# Altium schematic sheet 05_Part-3.SchDoc
size A3; SheetNumber: 5; SheetTotal: 5
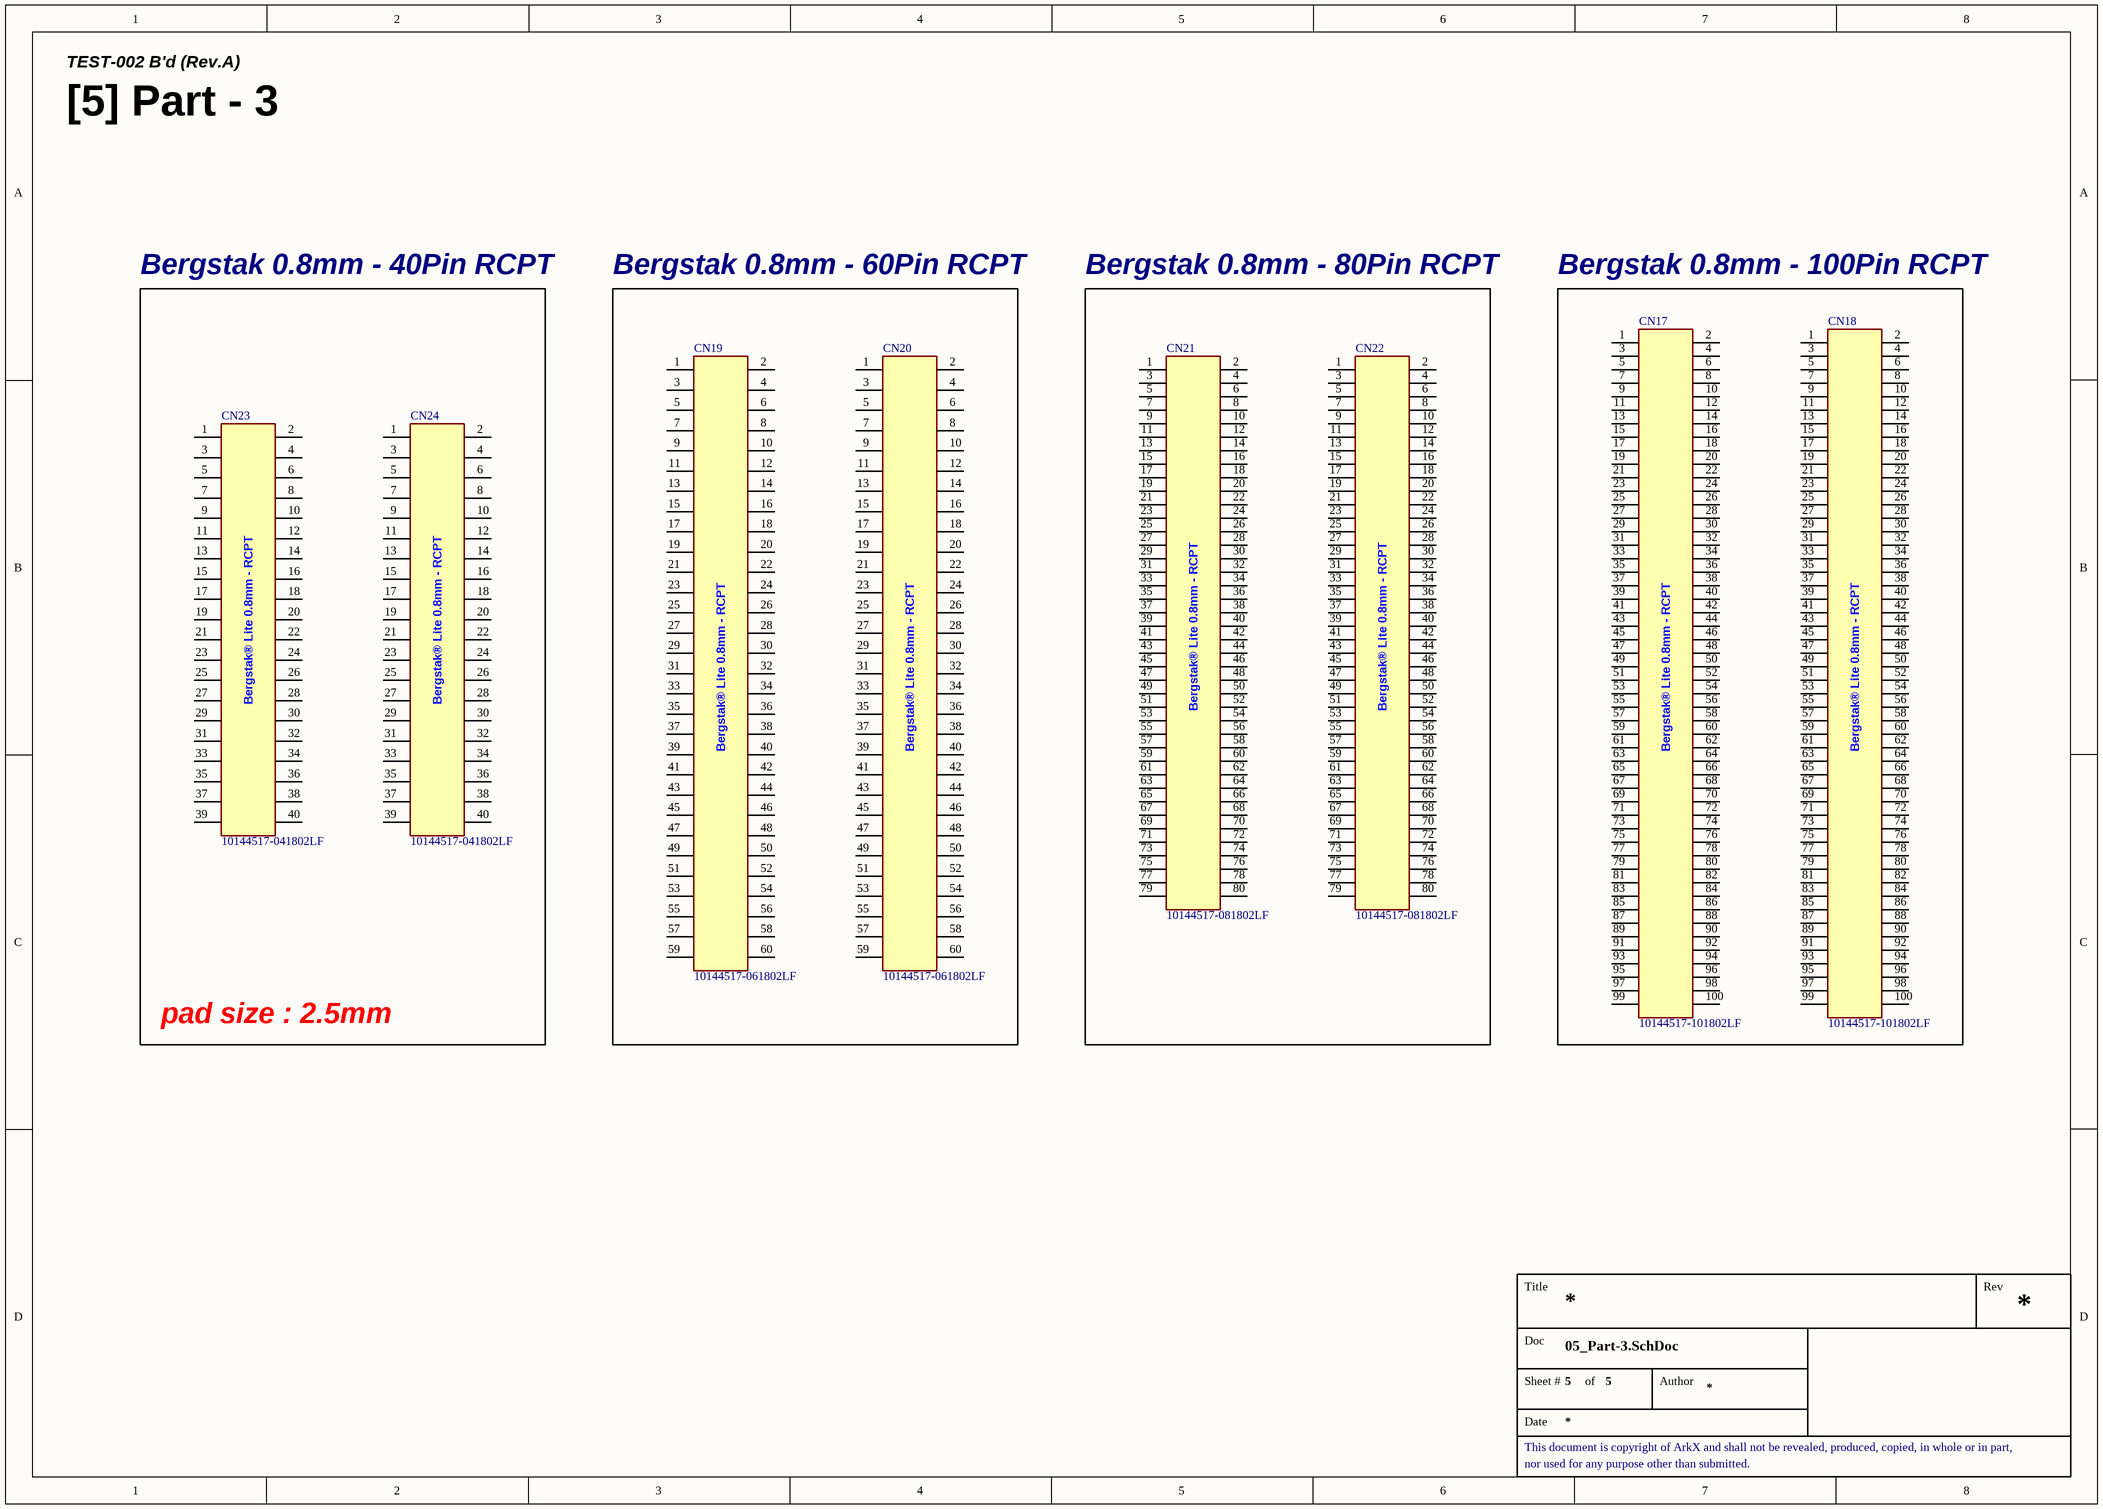
[diagram p0: 05_Part-3.SchDoc]

## Parts
CN17  10144517-101802LF  [CON_BergStak-Lite(0.8mm)_RCPT-100P(10144517-101802LF)_HandSolder]
CN18  10144517-101802LF  [CON_BergStak-Lite(0.8mm)_RCPT-100P(10144517-101802LF)_HandSolder]
CN19  10144517-061802LF  [CON_BergStak-Lite(0.8mm)_RCPT-60P(10144517-061802LF)_HandSolder]
CN20  10144517-061802LF  [CON_BergStak-Lite(0.8mm)_RCPT-60P(10144517-061802LF)_HandSolder]
CN21  10144517-081802LF  [CON_BergStak-Lite(0.8mm)_RCPT-80P(10144517-081802LF)_HandSolder]
CN22  10144517-081802LF  [CON_BergStak-Lite(0.8mm)_RCPT-80P(10144517-081802LF)_HandSolder]
CN23  10144517-041802LF  [CON_BergStak-Lite(0.8mm)_RCPT-40P(10144517-041802LF)_HandSolder]
CN24  10144517-041802LF  [CON_BergStak-Lite(0.8mm)_RCPT-40P(10144517-041802LF)_HandSolder]

## Blocks framed on the sheet
Bergstak 0.8mm - 60Pin RCPT: CN19 CN20
Bergstak 0.8mm - 80Pin RCPT: CN21 CN22
Bergstak 0.8mm - 100Pin RCPT: CN17 CN18

## Nets

Not connected (* = marked no-connect by the designer): CN17 1 2 3 4 5 6 7 8 9 10 11 12 13 14 15 16 17 18 19 20 21 22 23 24 25 26 27 28 29 30 31 32 33 34 35 36 37 38 39 40 41 42 43 44 45 46 47 48 49 50 51 52 53 54 55 56 57 58 59 60 61 62 63 64 65 66 67 68 69 70 71 72 73 74 75 76 77 78 79 80 81 82 83 84 85 86 87 88 89 90 91 92 93 94 95 96 97 98 99 100; CN18 1 2 3 4 5 6 7 8 9 10 11 12 13 14 15 16 17 18 19 20 21 22 23 24 25 26 27 28 29 30 31 32 33 34 35 36 37 38 39 40 41 42 43 44 45 46 47 48 49 50 51 52 53 54 55 56 57 58 59 60 61 62 63 64 65 66 67 68 69 70 71 72 73 74 75 76 77 78 79 80 81 82 83 84 85 86 87 88 89 90 91 92 93 94 95 96 97 98 99 100; CN19 1 2 3 4 5 6 7 8 9 10 11 12 13 14 15 16 17 18 19 20 21 22 23 24 25 26 27 28 29 30 31 32 33 34 35 36 37 38 39 40 41 42 43 44 45 46 47 48 49 50 51 52 53 54 55 56 57 58 59 60; CN20 1 2 3 4 5 6 7 8 9 10 11 12 13 14 15 16 17 18 19 20 21 22 23 24 25 26 27 28 29 30 31 32 33 34 35 36 37 38 39 40 41 42 43 44 45 46 47 48 49 50 51 52 53 54 55 56 57 58 59 60; CN21 1 2 3 4 5 6 7 8 9 10 11 12 13 14 15 16 17 18 19 20 21 22 23 24 25 26 27 28 29 30 31 32 33 34 35 36 37 38 39 40 41 42 43 44 45 46 47 48 49 50 51 52 53 54 55 56 57 58 59 60 61 62 63 64 65 66 67 68 69 70 71 72 73 74 75 76 77 78 79 80; CN22 1 2 3 4 5 6 7 8 9 10 11 12 13 14 15 16 17 18 19 20 21 22 23 24 25 26 27 28 29 30 31 32 33 34 35 36 37 38 39 40 41 42 43 44 45 46 47 48 49 50 51 52 53 54 55 56 57 58 59 60 61 62 63 64 65 66 67 68 69 70 71 72 73 74 75 76 77 78 79 80; CN23 1 2 3 4 5 6 7 8 9 10 11 12 13 14 15 16 17 18 19 20 21 22 23 24 25 26 27 28 29 30 31 32 33 34 35 36 37 38 39 40; CN24 1 2 3 4 5 6 7 8 9 10 11 12 13 14 15 16 17 18 19 20 21 22 23 24 25 26 27 28 29 30 31 32 33 34 35 36 37 38 39 40

## Notes on the sheet
- TEST-002 B'd (Rev.A)
- [5] Part - 3
- Bergstak 0.8mm - 40Pin RCPT
- pad size : 2.5mm
- Title
- Rev
- Doc
- Sheet #
- of
- Author
- This document is copyright of ArkX and shall not be revealed, produced, copied, in whole or in part,
- Date
- nor used for any purpose other than submitted.
- (in symbol CON_BergStak-Lite(0.8mm)_RCPT-40P(10144517-041802LF)) Bergstak® Lite 0.8mm - RCPT
- (in symbol CON_BergStak-Lite(0.8mm)_RCPT-60P(10144517-061802LF)) Bergstak® Lite 0.8mm - RCPT
- (in symbol CON_BergStak-Lite(0.8mm)_RCPT-80P(10144517-081802LF)) Bergstak® Lite 0.8mm - RCPT
- (in symbol CON_BergStak-Lite(0.8mm)_RCPT-100P(10144517-101802LF)) Bergstak® Lite 0.8mm - RCPT

## Library data of the parts
CN17 CN18 = CON_BergStak-Lite(0.8mm)_RCPT-100P(10144517-101802LF): LCSC Part #: C3648562; JLCPCB Part Type: Extended Part
CN19 CN20 = CON_BergStak-Lite(0.8mm)_RCPT-60P(10144517-061802LF): LCSC Part #: C2926919; JLCPCB Part Type: Extended Part
CN21 CN22 = CON_BergStak-Lite(0.8mm)_RCPT-80P(10144517-081802LF): LCSC Part #: None; JLCPCB Part Type: Extended Part
CN23 CN24 = CON_BergStak-Lite(0.8mm)_RCPT-40P(10144517-041802LF): LCSC Part #: C3645392; JLCPCB Part Type: Extended Part